# EasyEDA Pro project ProPrj_HSLinkTestBoard_2025-10-28.epro

# Schematic Schematic1
Board Name: Board1; Create Date: 2025-04-19; Page Name: P1; Project Name: HSLinkTestBoard; Schematic Name: Schematic1; Update Date: 2025-04-21; Company: 嘉立创EDA; Page Size: A4; Version: V1.0
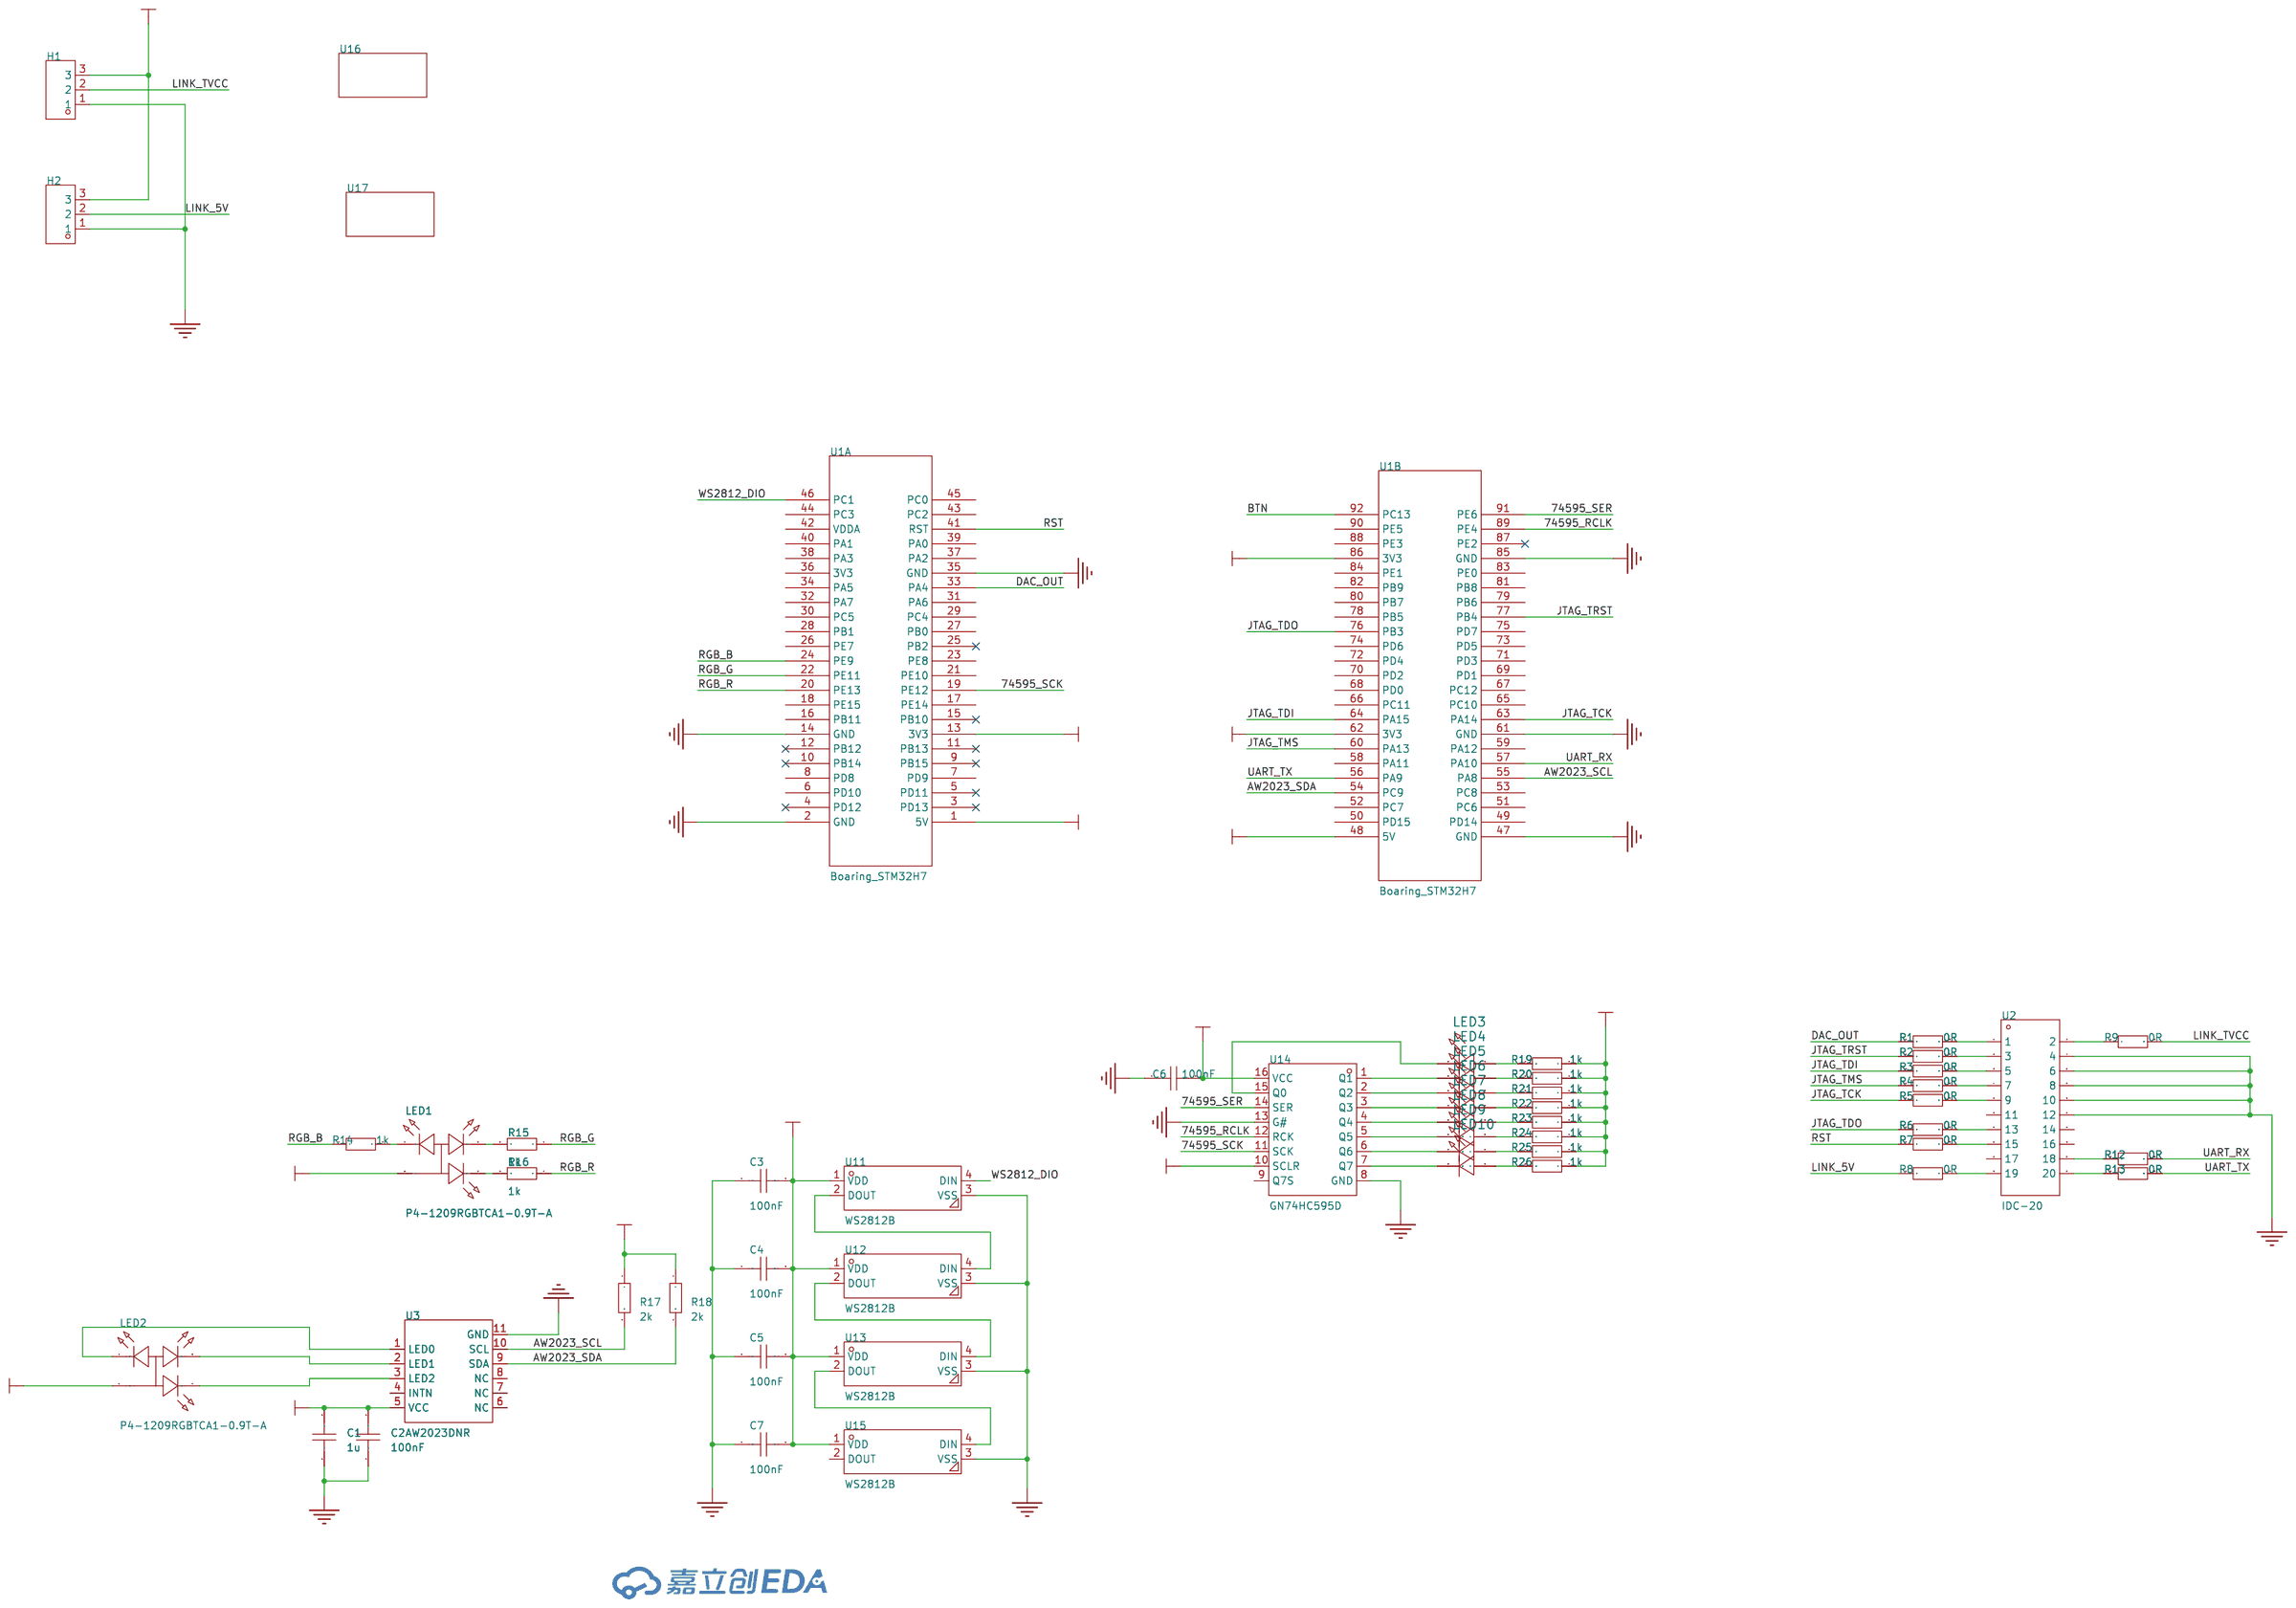
[diagram p0: schematic sheet]

## Parts
C1  1u  [C0603]
C2  100nF  [C0603]
C3  100nF  [C0603]
C4  100nF  [C0603]
C5  100nF  [C0603]
C6  100nF  [C0603]
C7  100nF  [C0603]
H1  -  [HDR-TH_3P-P2.54-V-F]
H2  -  [HDR-TH_3P-P2.54-V-F]
LED1  P4-1209RGBTCA1-0.9T-A  [LED-SMD_4P-L3.2-W2.7-TL-CW]
LED2  P4-1209RGBTCA1-0.9T-A  [LED-SMD_4P-L3.2-W2.7-TL-CW]
LED3  -  [LED_0603]
LED4  -  [LED_0603]
LED5  -  [LED_0603]
LED6  -  [LED_0603]
LED7  -  [LED_0603]
LED8  -  [LED_0603]
LED9  -  [LED_0603]
LED10  -  [LED_0603]
R1  0R  [R0603]
R2  0R  [R0603]
R3  0R  [R0603]
R4  0R  [R0603]
R5  0R  [R0603]
R6  0R  [R0603]
R7  0R  [R0603]
R8  0R  [R0603]
R9  0R  [R0603]
R12  0R  [R0603]
R13  0R  [R0603]
R14  1k  [R0603]
R15  1k  [R0603]
R16  1k  [R0603]
R17  2k  [R0603]
R18  2k  [R0603]
R19  1k  [R0603]
R20  1k  [R0603]
R21  1k  [R0603]
R22  1k  [R0603]
R23  1k  [R0603]
R24  1k  [R0603]
R25  1k  [R0603]
R26  1k  [R0603]
U1  Boaring_STM32H7  [Boaring_STM32H7]  (sections 1,2)
U2  IDC-20  [IDC-TH_20P-P2.54-V-R2-C10-S2.54]
U3  AW2023DNR  [DFN-10_L2.0-W2.0-P0.40-BL-EP]
U11  WS2812B  [LED-SMD_4P-L5.0-W5.0-TL]
U12  WS2812B  [LED-SMD_4P-L5.0-W5.0-TL]
U13  WS2812B  [LED-SMD_4P-L5.0-W5.0-TL]
U14  GN74HC595D  [SOP-16_L9.9-W3.9-P1.27-LS6.0-BL]
U15  WS2812B  [LED-SMD_4P-L5.0-W5.0-TL]
U16  -  [0.36寸裸表]
U17  -  [0.36寸裸表]

## Library data of the parts
C1-C7 = CAP_0603: Supplier Footprint: 0603
H1 H2 = HDR-F_2.54_1x3P: Supplier Part: C541850; Supplier Footprint: 插件
LED1 LED2 = P4-1209RGBTCA1-0.9T-A: LCSC Part Name: RGB三色; Supplier Part: C2827302; Manufacturer: TUOZHAN(拓展光电); Supplier Footprint: 1210; JLCPCB Part Class: 扩展库; Datasheet: https://atta.szlcsc.com/upload/public/pdf/source/20230317/55FD41526E8F063658A563CEBFD05C6F.pdf; Supplier: LCSC
LED3-LED10 = LED_0603-R: Supplier Footprint: 0603
R1-R9 R12-R26 = Res_0603: Supplier Footprint: 0603
U1 = Boaring_STM32H7
U2 = IDC-20: Supplier Part: C9900015890; Supplier Footprint: JTAG; JLCPCB Part Class: 扩展库; Supplier: LCSC
U3 = AW2023DNR: LCSC Part Name: 呼吸灯驱动; Supplier Part: C401014; Manufacturer: AWINIC(艾为); Supplier Footprint: DFN-10-EP(2x2); JLCPCB Part Class: 扩展库; Datasheet: https://atta.szlcsc.com/upload/public/pdf/source/20190701/C401014_E271E65E1E1F305DEBF1DEC8ED5DFBB8.pdf; Supplier: LCSC
U11-U13 U15 = WS2812B_1: Supplier Part: C9900106807; Supplier Footprint: SMD-LED-5328; JLCPCB Part Class: 扩展库; Supplier: LCSC
U14 = GN74HC595D: 低噪声、低功耗、高速的COMS移位寄存器，能够驱动15个LS-TTL的负载。8位串行输入，并行输出的移位寄存器及带有三态输出控制的8位D行储存器。; LCSC Part Name: 移位寄存器; Supplier Part: C22461436; Manufacturer: GN(旌芯半导体); Supplier Footprint: SOP-16; JLCPCB Part Class: 扩展库; Datasheet: https://atta.szlcsc.com/upload/public/pdf/source/20240605/C1B56835D1901C8811C7DC4991F054CF.pdf; Supplier: LCSC
U16 U17 = 0.36luobiao

## Nets
3.3V: C1.2 C2.2 C6.2 LED1.3(A) LED2.3(A) R17.1 R18.1 R19.1 R20.1 R21.1 R22.1 R23.1 R24.1 R25.1 R26.1 U1.13(3V3) U1.62(3V3) U1.86(3V3) U3.5(VCC) U14.10(SCLR) U14.16(VCC)
5V: C3.2 C4.2 C5.2 C7.2 H1.3 H2.3 U1.1(5V) U1.48(5V) U11.1(VDD) U12.1(VDD) U13.1(VDD) U15.1(VDD)
GND: C1.1 C2.1 C3.1 C4.1 C5.1 C6.1 C7.1 H1.1 H2.1 U1.2(GND) U1.14(GND) U1.35(GND) U1.47(GND) U1.61(GND) U1.85(GND) U2.4 U2.6 U2.8 U2.10 U2.12 U3.11(GND) U11.3(VSS) U12.3(VSS) U13.3(VSS) U14.8(GND) U14.13(G#) U15.3(VSS)
74595_RCLK: U1.89(PE4) U14.12(RCK)
74595_SCK: U1.19(PE12) U14.11(SCK)
74595_SER: U1.91(PE6) U14.14(SER)
AW2023_SCL: R17.2 U1.55(PA8) U3.10(SCL)
AW2023_SDA: R18.2 U1.54(PC9) U3.9(SDA)
BTN: U1.92(PC13)
DAC_OUT: R1.1 U1.33(PA4)
JTAG_TCK: R5.1 U1.63(PA14)
JTAG_TDI: R3.1 U1.64(PA15)
JTAG_TDO: R6.1 U1.76(PB3)
JTAG_TMS: R4.1 U1.60(PA13)
JTAG_TRST: R2.1 U1.77(PB4)
LINK_5V: H2.2 R8.1
LINK_TVCC: H1.2 R9.2
RGB_B: R14.1 U1.24(PE9)
RGB_G: R15.1 U1.22(PE11)
RGB_R: R16.1 U1.20(PE13)
RST: R7.1 U1.41(RST)
UART_RX: R12.2 U1.57(PA10)
UART_TX: R13.2 U1.56(PA9)
WS2812_DIO: U1.46(PC1) U11.4(DIN)
$1N1066: R1.2 U2.1
$1N1070: R2.2 U2.3
$1N1075: R3.2 U2.5
$1N1080: R4.2 U2.7
$1N1085: R5.2 U2.9
$1N1132: R6.2 U2.13
$1N1163: R7.2 U2.15
$1N1194: R8.2 U2.19
$1N1220: R9.1 U2.2
$1N1443: R12.1 U2.18
$1N1448: R13.1 U2.20
$1N1645: LED1.1(K) R14.2
$1N1680: LED1.2(K) R15.2
$1N1709: LED1.4(K) R16.2
$1N1996: LED2.2(K) U3.2(LED1)
$1N2016: LED2.4(K) U3.3(LED2)
$1N2050: LED2.1(K) U3.1(LED0)
$1N2657: U11.2(DOUT) U12.4(DIN)
$1N2671: U12.2(DOUT) U13.4(DIN)
$1N3018: LED3.1(C) U14.15(Q0)
$1N3024: LED3.2(A) R19.2
$1N3092: LED4.2(A) R20.2
$1N3143: LED5.2(A) R21.2
$1N3194: LED6.2(A) R22.2
$1N3245: LED7.2(A) R23.2
$1N3296: LED8.2(A) R24.2
$1N3347: LED9.2(A) R25.2
$1N3449: LED10.2(A) R26.2
$1N3471: LED4.1(C) U14.1(Q1)
$1N3475: LED5.1(C) U14.2(Q2)
$1N3480: LED6.1(C) U14.3(Q3)
$1N3485: LED7.1(C) U14.4(Q4)
$1N3490: LED8.1(C) U14.5(Q5)
$1N3495: LED9.1(C) U14.6(Q6)
$1N3500: LED10.1(C) U14.7(Q7)
$1N4542: U13.2(DOUT) U15.4(DIN)

Not connected (* = marked no-connect by the designer): U1 3(PD13)* 4(PD12)* 5(PD11)* 6(PD10) 7(PD9) 8(PD8) 9(PB15)* 10(PB14)* 11(PB13)* 12(PB12)* 15(PB10)* 16(PB11) 17(PE14) 18(PE15) 21(PE10) 23(PE8) 25(PB2)* 26(PE7) 27(PB0) 28(PB1) 29(PC4) 30(PC5) 31(PA6) 32(PA7) 34(PA5) 36(3V3) 37(PA2) 38(PA3) 39(PA0) 40(PA1) 42(VDDA) 43(PC2) 44(PC3) 45(PC0) 49(PD14) 50(PD15) 51(PC6) 52(PC7) 53(PC8) 58(PA11) 59(PA12) 65(PC10) 66(PC11) 67(PC12) 68(PD0) 69(PD1) 70(PD2) 71(PD3) 72(PD4) 73(PD5) 74(PD6) 75(PD7) 78(PB5) 79(PB6) 80(PB7) 81(PB8) 82(PB9) 83(PE0) 84(PE1) 87(PE2)* 88(PE3) 90(PE5); U2 11 14 16 17; U3 4(INTN) 6(NC) 7(NC) 8(NC); U14 9(Q7S); U15 2(DOUT)

# Board PCB1
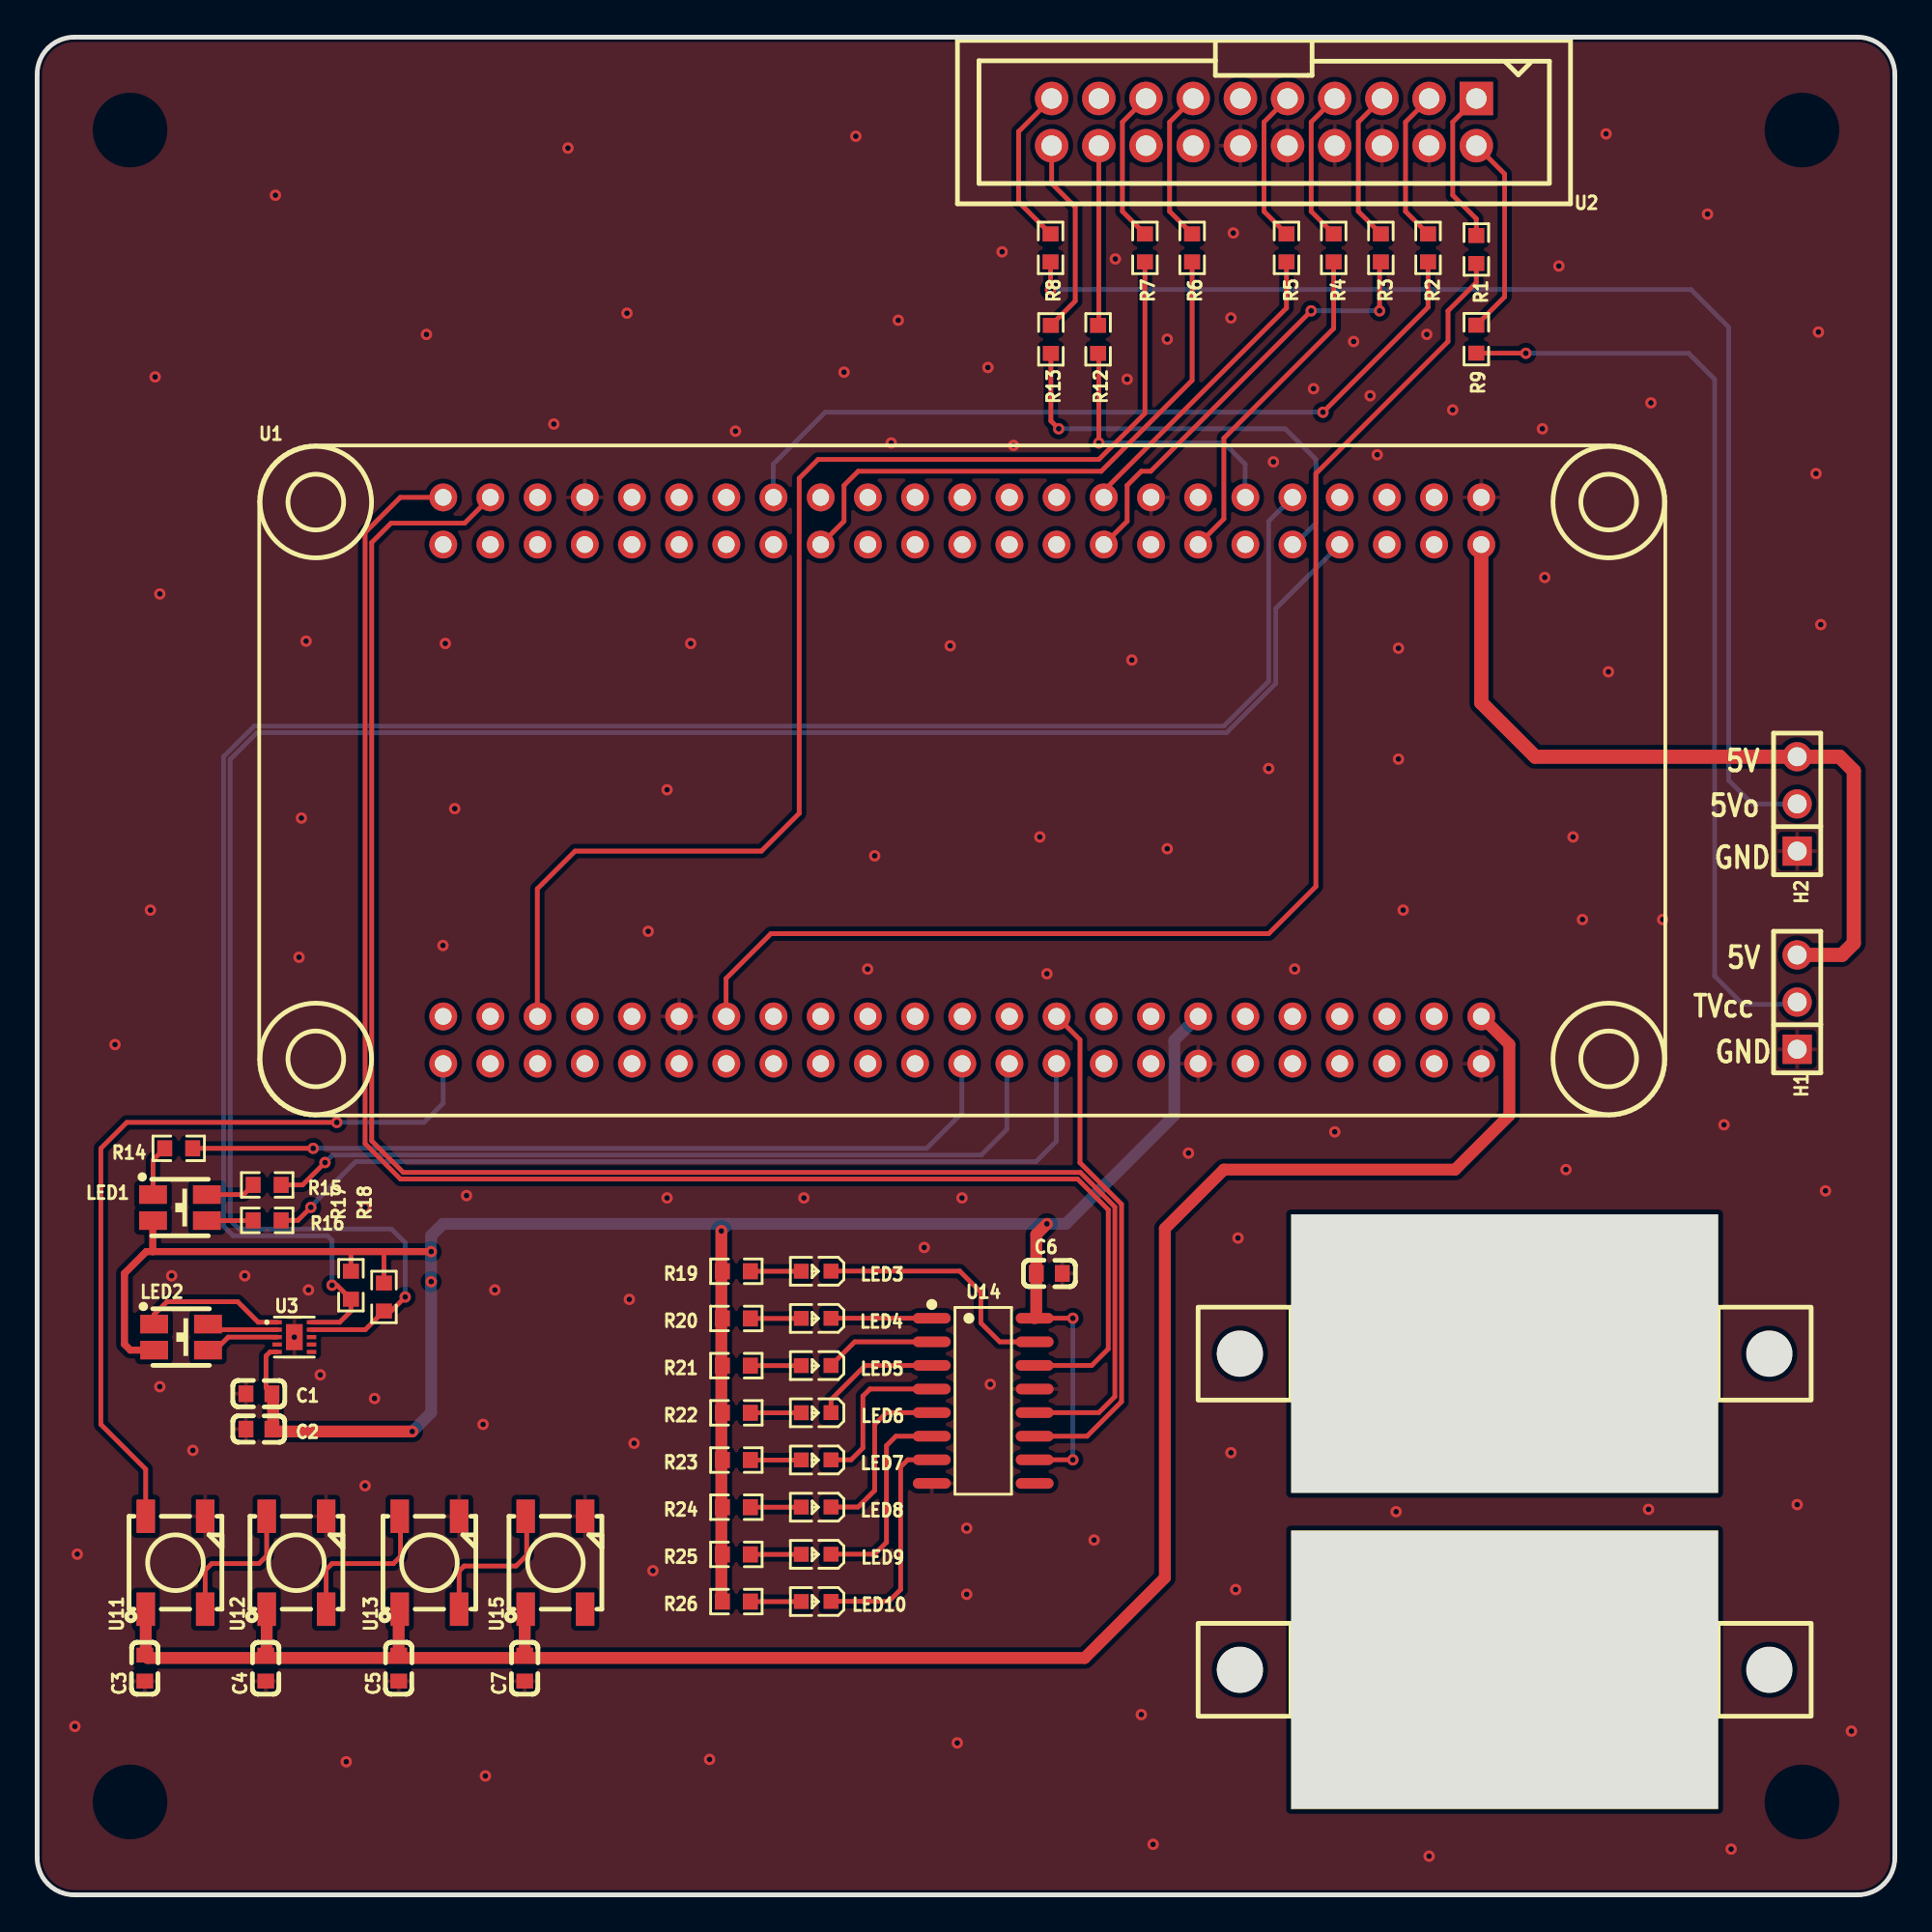
[diagram p1: board, top side]
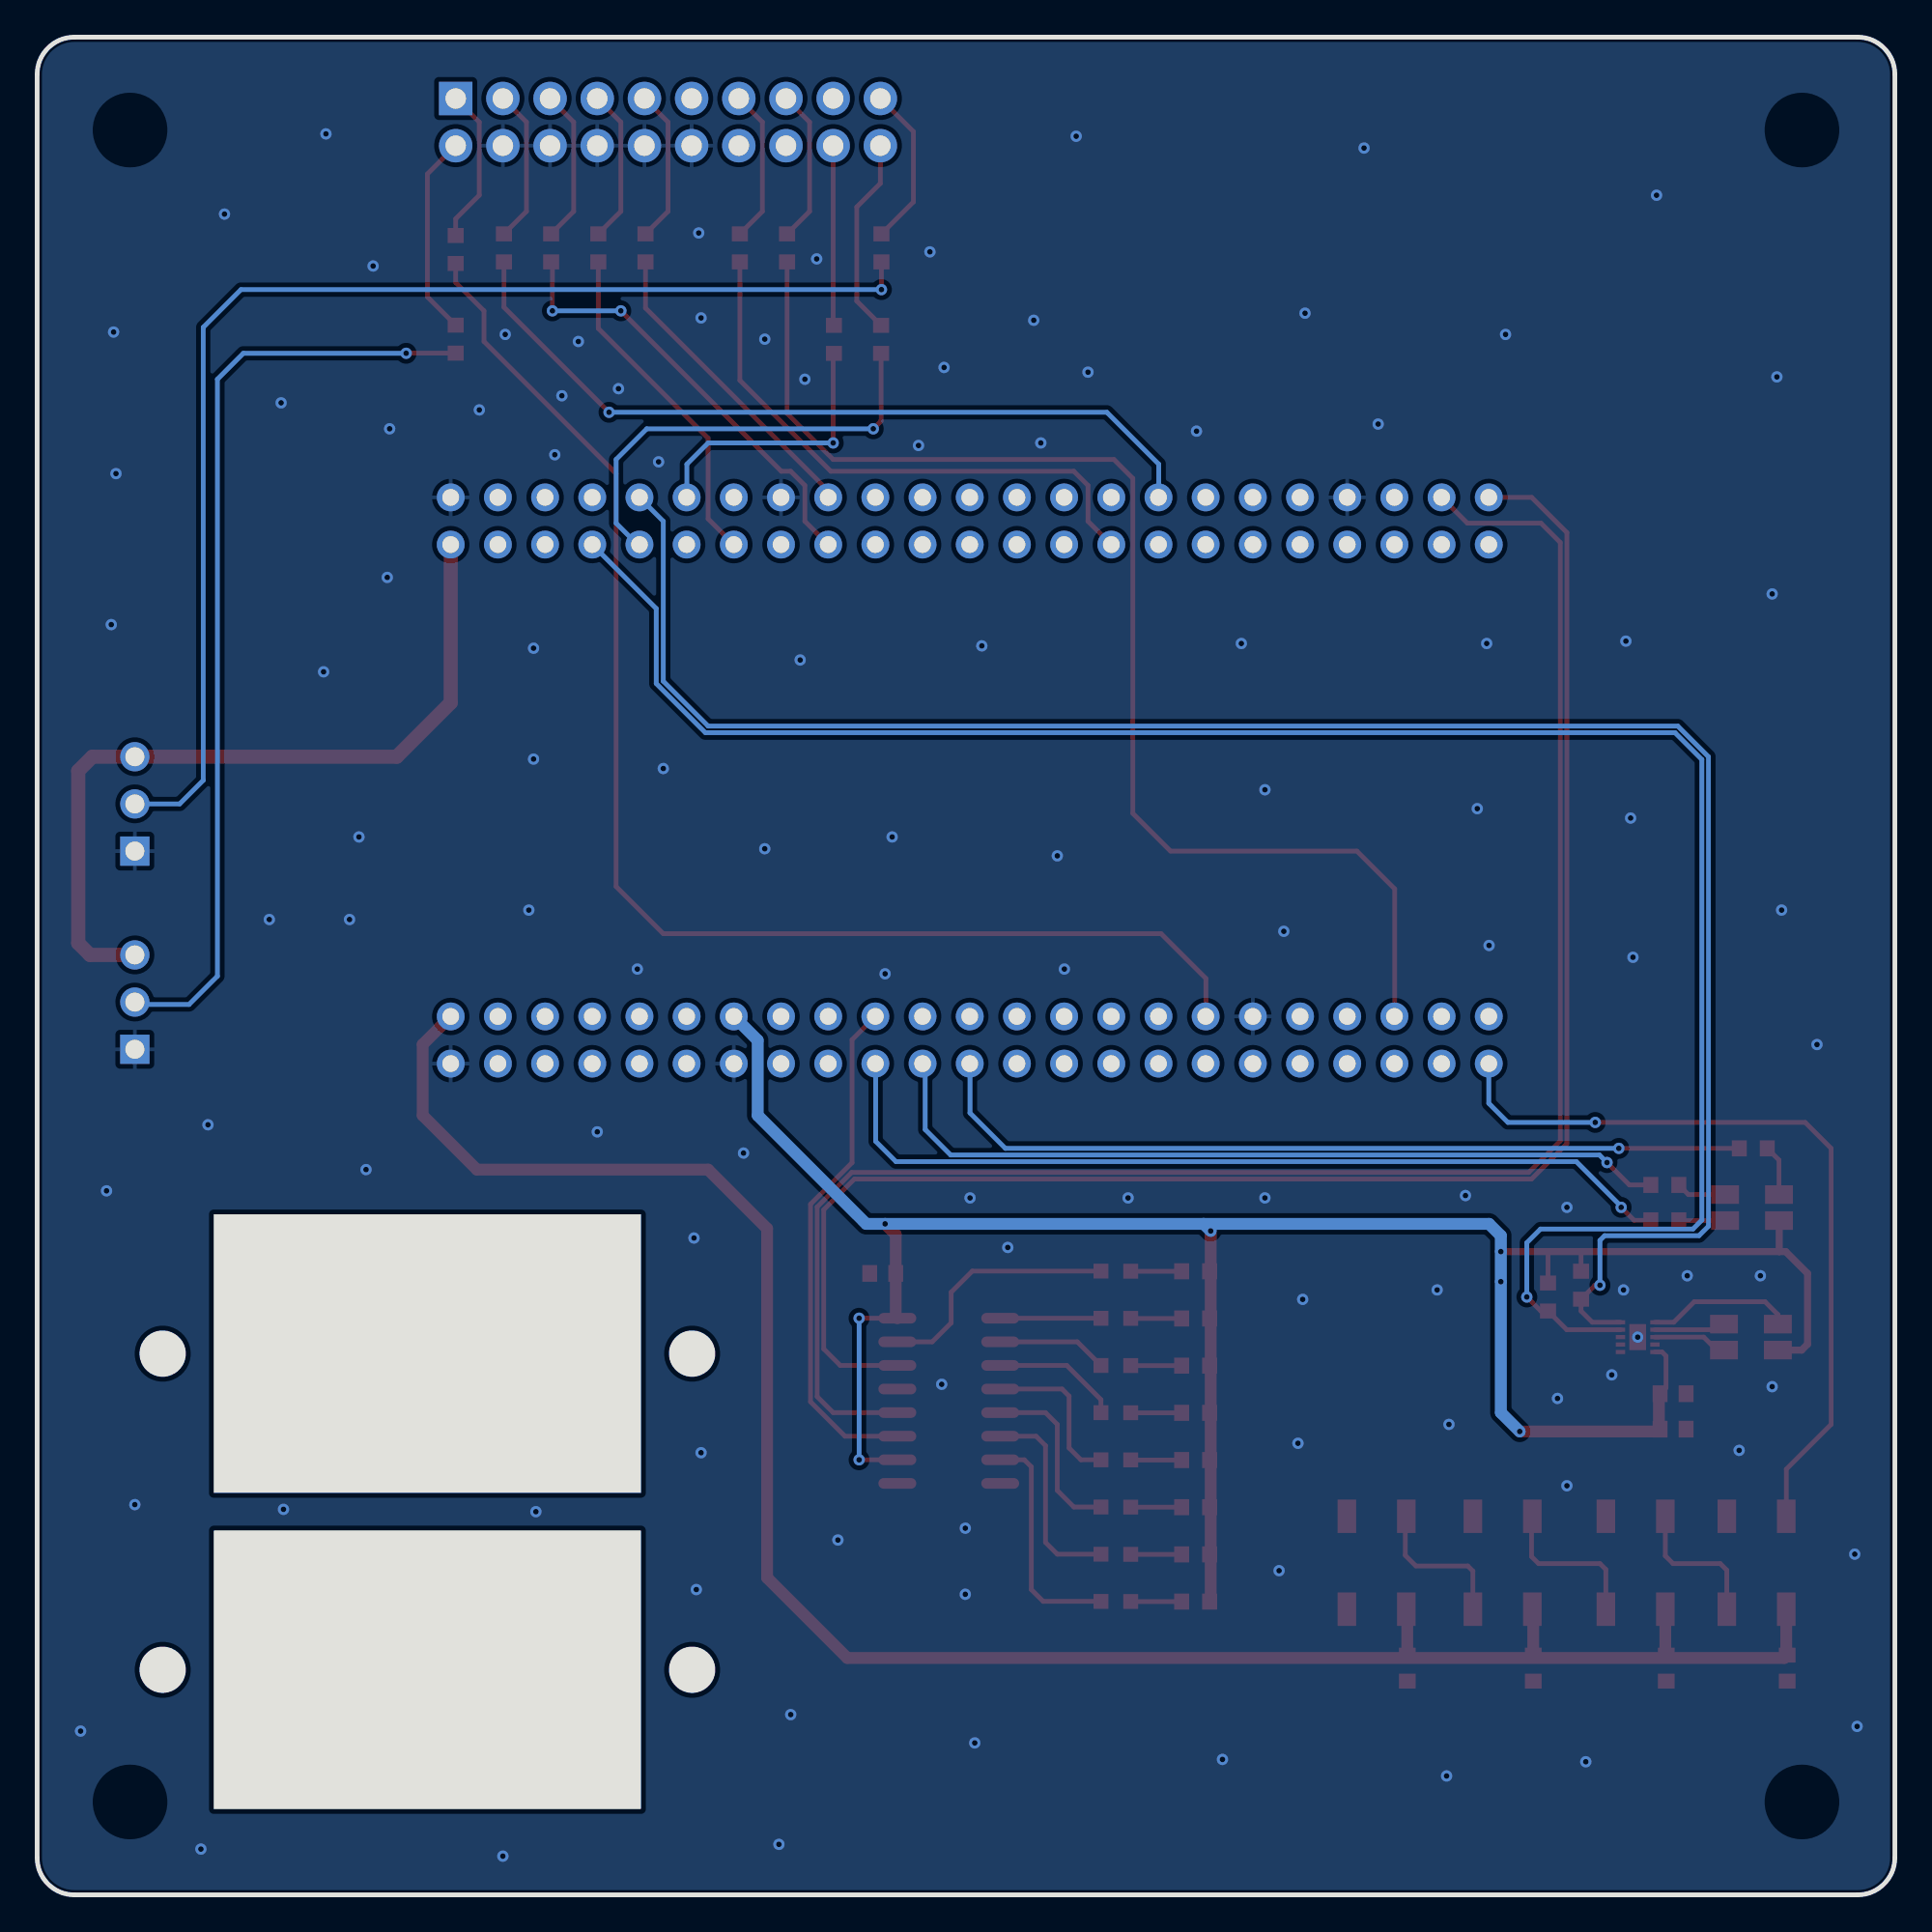
[diagram p2: board, bottom side, seen from below]

Outline 100 x 100 mm; copper layers: Top Layer, Bottom Layer. Coordinates in mm from the lower left corner of the outline.
Outline path: 0,98 0,2 arc(0.59,0.59) 2,0 98,0 arc(99.41,0.59) 100,2 100,98 arc(99.41,99.41) 98,100 2,100 arc(0.59,99.41) 0,98
Stack: Top Layer 0.035mm / Dielectric1 1.51mm FR4 er 4.5 / Bottom Layer 0.035mm

## Design rules (mm)
template: JLCPCB Capability(Two Layers Board)
spacing copperThickness1oz (default): track to track 0.102, other pairs 0.152 to 0.3
spacing copperThickness2oz: track to track 0.203, other pairs 0.152 to 0.3
track width copperThickness1oz (default): min 0.127, default 0.254, max 2.54
track width copperThickness2oz: min 0.203, default 0.254, max 2.54
differential pair differentialPair (default): width min 0.127, default 0.254, max 2.54; gap min 0.152, default 0.152
via viaSize (default): diameter min 0.5, default 0.61, max 10; hole min 0.3, default 0.305, max 6.3

## Placement (name value [footprint] x y rotation side)
C1  1u  [C0603]  11.94 26.97 0 top
C2  100nF  [C0603]  11.94 25.07 0 top
C3  100nF  [C0603]  5.8 12.21 90 top
C4  100nF  [C0603]  12.3 12.21 90 top
C5  100nF  [C0603]  19.46 12.21 90 top
C6  100nF  [C0603]  54.48 33.45 180 top
C7  100nF  [C0603]  26.25 12.21 90 top
H1  -  [HDR-TH_3P-P2.54-V-F]  94.74 48.06 90 top
H2  -  [HDR-TH_3P-P2.54-V-F]  94.74 58.72 90 top
LED1  P4-1209RGBTCA1-0.9T-A  [LED-SMD_4P-L3.2-W2.7-TL-CW]  7.69 37 0 top
LED2  P4-1209RGBTCA1-0.9T-A  [LED-SMD_4P-L3.2-W2.7-TL-CW]  7.75 30.02 0 top
LED3  -  [LED_0603]  41.88 33.57 180 top
LED4  -  [LED_0603]  41.88 31.03 180 top
LED5  -  [LED_0603]  41.88 28.49 180 top
LED6  -  [LED_0603]  41.88 25.95 180 top
LED7  -  [LED_0603]  41.88 23.41 180 top
LED8  -  [LED_0603]  41.88 20.87 180 top
LED9  -  [LED_0603]  41.88 18.33 180 top
LED10  -  [LED_0603]  41.88 15.79 180 top
R1  0R  [R0603]  77.47 88.57 90 top
R2  0R  [R0603]  74.87 88.66 90 top
R3  0R  [R0603]  72.33 88.66 90 top
R4  0R  [R0603]  69.79 88.66 90 top
R5  0R  [R0603]  67.25 88.66 90 top
R6  0R  [R0603]  62.17 88.66 90 top
R7  0R  [R0603]  59.63 88.66 90 top
R8  0R  [R0603]  54.55 88.66 90 top
R9  0R  [R0603]  77.47 83.74 270 top
R12  0R  [R0603]  57.11 83.73 270 top
R13  0R  [R0603]  54.57 83.73 270 top
R14  1k  [R0603]  7.62 40.18 180 top
R15  1k  [R0603]  12.38 38.21 180 top
R16  1k  [R0603]  12.38 36.31 180 top
R17  2k  [R0603]  16.89 32.82 270 top
R18  2k  [R0603]  18.67 32.18 270 top
R19  1k  [R0603]  37.64 33.57 0 top
R20  1k  [R0603]  37.64 31.03 0 top
R21  1k  [R0603]  37.64 28.49 0 top
R22  1k  [R0603]  37.64 25.95 0 top
R23  1k  [R0603]  37.64 23.41 0 top
R24  1k  [R0603]  37.64 20.87 0 top
R25  1k  [R0603]  37.64 18.33 0 top
R26  1k  [R0603]  37.64 15.79 0 top
U1  -  [Boaring_STM32H7]  15 45 0 top
U2  IDC-20  [IDC-TH_20P-P2.54-V-R2-C10-S2.54]  66.04 95.43 180 top
U3  AW2023DNR  [DFN-10_L2.0-W2.0-P0.40-BL-EP]  13.84 30.02 270 top
U11  WS2812B  [LED-SMD_4P-L5.0-W5.0-TL]  7.45 17.88 90 top
U12  WS2812B  [LED-SMD_4P-L5.0-W5.0-TL]  13.96 17.88 90 top
U13  WS2812B  [LED-SMD_4P-L5.0-W5.0-TL]  21.11 17.88 90 top
U14  GN74HC595D  [SOP-16_L9.9-W3.9-P1.27-LS6.0-BL]  50.93 26.59 270 top
U15  WS2812B  [LED-SMD_4P-L5.0-W5.0-TL]  27.9 17.88 90 top
U16  -  [0.36寸裸表]  78.99 29.13 0 top
U17  -  [0.36寸裸表]  78.99 12.12 0 top

## Footprints (pads in the part's own frame, mm; a bottom-side part is the same pattern mirrored in y, then rotated)
Boaring_STM32H7
  round 1.5 hole 0.9: 1(62.738,2.286) 2(62.738,-0.254) 3(60.198,2.286) 4(60.198,-0.254) 5(57.658,2.286) 6(57.658,-0.254) 7(55.118,2.286) 8(55.118,-0.254) 9(52.578,2.286) 10(52.578,-0.254) 11(50.038,2.286) 12(50.038,-0.254) 13(47.498,2.286) 14(47.498,-0.254) 15(44.958,2.286) 16(44.958,-0.254) 17(42.418,2.286) 18(42.418,-0.254) 19(39.878,2.286) 20(39.878,-0.254) 21(37.338,2.286) 22(37.338,-0.254) 23(34.798,2.286) 24(34.798,-0.254) 25(32.258,2.286) 26(32.258,-0.254) 27(29.718,2.286) 28(29.718,-0.254) 29(27.178,2.286) 30(27.178,-0.254) 31(24.638,2.286) 32(24.638,-0.254) 33(22.098,2.286) 34(22.098,-0.254) 35(19.558,2.286) 36(19.558,-0.254) 37(17.018,2.286) 38(17.018,-0.254) 39(14.478,2.286) 40(14.478,-0.254) 41(11.938,2.286) 42(11.938,-0.254) 43(9.398,2.286) 44(9.398,-0.254) 45(6.858,2.286) 46(6.858,-0.254) 47(62.738,30.226) 48(62.738,27.686) 49(60.198,30.226) 50(60.198,27.686) 51(57.658,30.226) 52(57.658,27.686) 53(55.118,30.226) 54(55.118,27.686) 55(52.578,30.226) 56(52.578,27.686) 57(50.038,30.226) 58(50.038,27.686) 59(47.498,30.226) 60(47.498,27.686) 61(44.958,30.226) 62(44.958,27.686) 63(42.418,30.226) 64(42.418,27.686) 65(39.878,30.226) 66(39.878,27.686) 67(37.338,30.226) 68(37.338,27.686) 69(34.798,30.226) 70(34.798,27.686) 71(32.258,30.226) 72(32.258,27.686) 73(29.718,30.226) 74(29.718,27.686) 75(27.178,30.226) 76(27.178,27.686) 77(24.638,30.226) 78(24.638,27.686) 79(22.098,30.226) 80(22.098,27.686) 81(19.558,30.226) 82(19.558,27.686) 83(17.018,30.226) 84(17.018,27.686) 85(14.478,30.226) 86(14.478,27.686) 87(11.938,30.226) 88(11.938,27.686) 89(9.398,30.226) 90(9.398,27.686) 91(6.858,30.226) 92(6.858,27.686)
C0603
  rect 0.8x0.9 smd: 1(-0.7,0) 2(0.7,0)
DFN-10_L2.0-W2.0-P0.40-BL-EP
  rect 0.224x0.505 smd: 1(-0.8,-0.927) 2(-0.4,-0.927) 3(0,-0.927) 4(0.4,-0.927) 5(0.8,-0.927) 6(0.8,0.927) 7(0.4,0.927) 8(0,0.927) 9(-0.4,0.927) 10(-0.8,0.927)
  rect 1.4x0.9 smd: 11(0,0)
HDR-TH_3P-P2.54-V-F
  rect 1.575x1.575 hole 1.02: 1(-2.54,0)
  round 1.575 hole 1.02: 2(0,0) 3(2.54,0)
IDC-TH_20P-P2.54-V-R2-C10-S2.54
  rect 1.8x1.8 hole 1.1: 1(-11.43,-1.27)
  round 1.8 hole 1.1: 2(-11.43,1.27) 3(-8.89,-1.27) 4(-8.89,1.27) 5(-6.35,-1.27) 6(-6.35,1.27) 7(-3.81,-1.27) 8(-3.81,1.27) 9(-1.27,-1.27) 10(-1.27,1.27) 11(1.27,-1.27) 12(1.27,1.27) 13(3.81,-1.27) 14(3.81,1.27) 15(6.35,-1.27) 16(6.35,1.27) 17(8.89,-1.27) 18(8.89,1.27) 19(11.43,-1.27) 20(11.43,1.27)
LED-SMD_4P-L3.2-W2.7-TL-CW
  rect 1.5x1 smd: 1(-1.45,0.7) 2(1.45,0.7) 3(-1.45,-0.7) 4(1.45,-0.7)
LED-SMD_4P-L5.0-W5.0-TL
  rect 1.8x1 smd: 1(-2.5,1.6) 2(-2.5,-1.6) 3(2.5,-1.6) 4(2.5,1.6)
LED_0603
  rect 0.8x0.8 smd: 1(-0.851,-0.01) 2(0.75,-0.005)
R0603
  rect 0.806x0.864 smd: 1(-0.753,0) 2(0.753,0)
SOP-16_L9.9-W3.9-P1.27-LS6.0-BL
  oval 0.574x2.038 smd: 1(-4.445,-2.769) 2(-3.175,-2.769) 3(-1.905,-2.769) 4(-0.635,-2.769) 5(0.635,-2.769) 6(1.905,-2.769) 7(3.175,-2.769) 8(4.445,-2.769) 9(4.445,2.769) 10(3.175,2.769) 11(1.905,2.769) 12(0.635,2.769) 13(-0.635,2.769) 14(-1.905,2.769) 15(-3.175,2.769) 16(-4.445,2.769)

## Nets
As in the schematic.

Pads without a net: U1 3 4 5 6 7 8 9 10 11 12 15 16 17 18 21 23 25 26 27 28 29 30 31 32 34 36 37 38 39 40 42 43 44 45 49 50 51 52 53 58 59 65 66 67 68 69 70 71 72 73 74 75 78 79 80 81 82 83 84 87 88 90; U2 11 14 16 17; U3 4 6 7 8; U14 9; U15 2

## Via types
v1: diameter 0.61, hole 0.305, Top Layer to Bottom Layer, 129 vias

## Routing (per net, layer and track width the routed paths; a pad name or vN(x,y) marks a point on that pad's centre or on a via; arc(x,y) is an arc through that point)
3.3V: length 136.4
  Top Layer w0.254: R18.1 18.67,34.62 18.66,34.63 ; 16.9,34.63 16.89,34.62 R17.1 ; 12.92,29.22 12.53,29.22 12.32,29.01 12.32,27.29 C1.2 ; 53.7,23.42 v1(55.75,23.42) ; v1(55.75,31.04) U14.16
  Top Layer w0.381: LED2.3 5.02,29.32 4.7,29.64 4.7,33.45 5.87,34.63 6.22,34.63 ; 6.22,34.63 v1(21.21,34.63) ; 6.22,34.63 6.22,36.28 LED1.3
  Top Layer w0.635: v1(20.19,24.94) 12.83,24.94 12.7,25.07 12.7,26.91 C1.2 ; v1(36.83,35.74) 36.83,15.84 36.89,15.79 ; U14.16 53.78,31.13 C6.2 53.78,35.55 v1(54.36,36.12)
  Bottom Layer w0.254: v1(55.75,23.42) v1(55.75,31.04)
  Bottom Layer w0.635: 37.21,36.12 v1(54.36,36.12) 55.37,36.12 61.21,41.96 61.21,46 U1.13 ; 37.21,36.12 21.84,36.12 21.21,35.48 v1(21.21,34.63) v1(21.21,33.01) 21.21,25.96 v1(20.19,24.94) ; 37.21,36.12 v1(36.83,35.74)
5V: length 155.2
  Top Layer w0.635: U11.1 5.85,12.96 C3.2 5.95,12.75 56.39,12.75 60.71,17.07 60.71,35.86 63.88,39.04 76.33,39.04 79.25,41.96 79.25,45.78 U1.1 ; C5.2 19.46,15.33 19.52,15.38 ; C7.2 26.25,15.33 26.3,15.38 ; C4.2 12.36,12.96 U12.1
  Top Layer w0.762: U1.48 77.74,64.17 80.65,61.27 H2.3 97.03,61.27 97.79,60.5 97.79,51.23 97.16,50.6 94.74,50.6
GND:
  vias: v1(2.03,9.07) v1(2.16,18.34) v1(4.19,45.77) v1(6.1,53.01) v1(6.35,81.71) v1(6.6,70.03) v1(6.6,27.36) v1(7.24,33.33) v1(8.38,23.93) v1(11.18,33.33) v1(12.83,91.49) v1(13.84,30.02) v1(14.1,50.47) v1(14.22,57.96) v1(14.48,67.49) v1(14.61,32.56) v1(15.24,27.99) v1(16.64,7.16) v1(17.65,37.01) v1(17.65,22.02) v1(18.16,26.72) v1(20.95,84) v1(21.84,51.11) v1(21.97,67.36) v1(22.48,58.47) v1(23.11,37.64) v1(24,25.32) v1(24.13,6.4) v1(24.64,32.56) v1(27.81,79.17) v1(28.57,94.03) v1(31.75,85.14) v1(31.88,32.06) v1(32.13,24.31) v1(32.89,51.87) v1(33.15,17.45) v1(33.91,59.49) v1(33.91,37.52) v1(35.18,67.36) v1(36.19,7.29) v1(37.59,78.79) v1(41.28,37.52) v1(43.43,81.97) v1(44.07,94.67) v1(44.7,49.83) v1(45.09,55.93) v1(45.97,78.16) v1(46.35,84.76) v1(47.75,34.85) v1(49.15,67.23) v1(49.53,8.18) v1(49.78,37.52) v1(50.04,19.74) v1(50.04,16.18) v1(51.18,82.22) v1(51.31,27.48) v1(51.94,88.44) v1(52.56,78.02) v1(53.97,56.95) v1(54.36,49.58) v1(56.9,19.1) v1(58.04,88.06) v1(58.67,81.58) v1(58.93,66.47) v1(59.44,9.7) v1(60.07,2.72) v1(60.83,83.74) v1(60.83,56.31) v1(61.98,39.93) v1(64.26,84.89) v1(64.26,23.8) v1(64.39,89.46) v1(64.52,16.43) v1(64.64,35.36) v1(66.29,60.63) v1(66.55,77.14) v1(67.69,49.83) v1(68.71,81.08) v1(69.85,41.07) v1(70.87,83.62) v1(71.75,80.7) v1(72.14,77.52) v1(73.15,20.62) v1(73.28,67.11) v1(73.28,61.14) v1(73.53,53.01) v1(74.8,84) v1(74.93,2.08) v1(76.2,79.93) v1(81.03,78.92) v1(81.15,70.92) v1(81.91,87.68) v1(82.3,39.04) v1(82.68,56.95) v1(83.19,52.5) v1(84.46,94.79) v1(84.58,65.84) v1(86.74,20.75) v1(86.87,80.31) v1(87.5,52.5) v1(89.92,90.47) v1(90.81,41.45) v1(91.19,2.46) v1(94.74,21.01) v1(95.76,76.5) v1(95.88,84.12) v1(96.01,68.38) v1(96.27,37.9) v1(97.66,8.81)
74595_RCLK: length 96
  Top Layer w0.254: U1.89 23.01,73.84 19.05,73.84 18.01,72.8 18.01,40.58 19.71,38.89 56.15,38.89 58.01,37.03 58.01,26.82 57.15,25.96 U14.12
74595_SCK: length 27.6
  Top Layer w0.254: U1.19 56.13,46.03 56.13,39.41 58.37,37.18 58.37,26.54 56.51,24.69 U14.11
74595_SER: length 91.2
  Top Layer w0.254: U1.91 19.55,75.23 17.65,73.33 17.65,40.44 19.56,38.53 56.01,38.53 57.66,36.88 57.66,29.39 56.77,28.5 U14.14
AW2023_SCL: length 106.6
  Top Layer w0.254: v1(15.88,32.82) 16.14,32.82 R17.2 16.89,31.43 16.28,30.82 U3.10
  Bottom Layer w0.254: U1.55 66.29,73.94 66.29,65.33 63.88,62.92 11.68,62.92 10.03,61.27 10.03,35.99 10.54,35.48 15.62,35.48 15.88,35.23 v1(15.88,32.82)
AW2023_SDA: length 110.3
  Top Layer w0.254: v1(19.81,32.18) 19.06,31.43 R18.2 17.66,30.42 U3.9
  Bottom Layer w0.254: v1(19.81,32.18) 19.81,35.1 19.08,35.84 10.87,35.84 10.39,36.32 10.39,61.12 11.83,62.56 64.03,62.56 66.68,65.21 66.68,69.24 U1.54
DAC_OUT: length 73
  Top Layer w0.254: R1.1 77.47,86.79 75.95,85.27 75.95,83.62 68.83,76.5 68.83,54.28 66.29,51.74 39.5,51.74 37.08,49.33 37.08,47.3 U1.33
JTAG_TCK: length 16.7
  Top Layer w0.254: U1.63 57.42,75.58 67.25,85.42 R5.1
JTAG_TDI: length 23.8
  Top Layer w0.254: R3.1 72.26,87.83 v1(72.26,85.27) ; v1(68.58,85.27) 59.94,76.63 59.44,76.63 58.67,75.87 58.67,73.94 U1.64
  Bottom Layer w0.254: v1(68.58,85.27) v1(72.26,85.27)
JTAG_TDO: length 31.2
  Top Layer w0.254: U1.76 43.43,73.94 43.43,75.87 44.2,76.63 57.28,76.63 62.17,81.53 R6.1
JTAG_TMS: length 18.2
  Top Layer w0.254: R4.1 69.79,84.32 63.88,78.41 63.88,74.07 U1.60
JTAG_TRST: length 43
  Top Layer w0.254: v1(69.22,79.81) 74.87,85.46 R2.1
  Bottom Layer w0.254: U1.77 39.62,75.24 39.62,77.01 42.42,79.81 v1(69.22,79.81)
LINK_5V: length 67.4
  Top Layer w0.254: R8.1 v1(54.55,86.41)
  Bottom Layer w0.254: H2.2 92.33,58.72 91.06,60 91.06,84.38 89.03,86.41 v1(54.55,86.41)
LINK_TVCC: length 50.7
  Top Layer w0.254: v1(80.14,82.98) 80.13,82.99 R9.2
  Bottom Layer w0.254: H1.2 94.62,47.93 91.82,47.93 90.3,49.45 90.3,81.58 88.9,82.98 v1(80.14,82.98)
RGB_B: length 44.9
  Top Layer w0.254: R14.1 v1(14.86,40.18)
  Bottom Layer w0.254: v1(14.86,40.18) 47.88,40.18 49.78,42.09 49.78,44.73 U1.24
RGB_G: length 43.9
  Top Layer w0.254: v1(15.49,39.42) 14.29,38.21 R15.1
  Bottom Layer w0.254: U1.22 52.2,44.61 52.2,41.2 50.82,39.83 15.9,39.83 v1(15.49,39.42)
RGB_R: length 47.7
  Top Layer w0.254: v1(14.73,37.01) 14.03,36.31 R16.1
  Bottom Layer w0.254: v1(14.73,37.01) 14.73,37.06 17.14,39.47 53.77,39.47 54.86,40.56 54.86,44.73 U1.20
RST: length 68.9
  Top Layer w0.254: U1.41 26.92,47.3 26.92,54.15 28.96,56.19 38.99,56.19 41.02,58.22 41.02,76.25 42.04,77.27 57.15,77.27 59.63,79.75 R7.1
UART_RX: length 15
  Top Layer w0.254: R12.2 57.15,82.94 v1(57.15,78.16)
  Bottom Layer w0.254: U1.57 65.02,75.24 65.02,77.01 63.88,78.16 v1(57.15,78.16)
UART_TX: length 23.9
  Top Layer w0.254: v1(54.99,78.92) 54.57,79.34 R13.2
  Bottom Layer w0.254: U1.56 67.68,72.69 68.83,73.84 68.83,77.27 67.18,78.92 v1(54.99,78.92)
WS2812_DIO: length 42.4
  Top Layer w0.254: v1(16.13,41.58) 4.83,41.58 3.43,40.18 3.43,25.32 5.84,22.91 5.84,20.38 U11.4
  Bottom Layer w0.254: v1(16.13,41.58) 20.83,41.58 21.86,42.61 U1.46
$1N1066: length 8.4
  Top Layer w0.254: R1.2 77.47,90.22 76.2,91.49 76.2,95.43 U2.1
$1N1070: length 8.3
  Top Layer w0.254: R2.2 73.66,90.62 73.66,95.43 U2.3
$1N1075: length 8.3
  Top Layer w0.254: U2.5 71.12,95.43 71.12,90.62 R3.2
$1N1080: length 8.3
  Top Layer w0.254: R4.2 68.58,90.62 68.58,95.43 U2.7
$1N1085: length 8.3
  Top Layer w0.254: R5.2 66.04,90.62 66.04,95.43 U2.9
$1N1132: length 8.3
  Top Layer w0.254: U2.13 60.96,95.43 60.96,90.62 R6.2
$1N1163: length 8.3
  Top Layer w0.254: U2.15 58.42,95.43 58.42,90.62 R7.2
$1N1194: length 8.7
  Top Layer w0.254: U2.19 52.83,94.92 52.83,91.13 R8.2
$1N1220: length 10.9
  Top Layer w0.254: U2.2 78.99,92.63 78.99,86.02 R9.1
$1N1443: length 9.7
  Top Layer w0.254: R12.1 57.15,84.53 U2.18
$1N1448: length 10.7
  Top Layer w0.254: U2.20 54.61,92.13 55.88,90.86 55.88,85.8 R13.1
$1N1645: length 2.7
  Top Layer w0.254: R14.2 6.24,39.55 LED1.1
$1N1680: length 2.7
  Top Layer w0.254: R15.2 11.11,37.7 LED1.2
$1N1709: length 2.5
  Top Layer w0.254: LED1.4 11.61,36.3 R16.2
$1N1996: length 3.8
  Top Layer w0.254: 9.2,30.72 9.5,30.42 U3.2
$1N2016: length 4
  Top Layer w0.254: LED2.4 9.59,29.32 10.29,30.02 U3.3
$1N2050: length 7.9
  Top Layer w0.254: U3.1 11.9,30.82 10.8,31.93 6.98,31.93 6.3,31.24 6.3,30.72
$1N2657: length 7.9
  Top Layer w0.254: U12.4 12.36,18.25 11.94,17.83 9.4,17.83 9.05,17.48 U11.2
$1N2671: length 8.6
  Top Layer w0.254: 19.52,20.38 19.56,20.33 19.56,18.21 19.18,17.83 15.88,17.83 15.56,17.51 U12.2
$1N3018: length 13.5
  Top Layer w0.254: U14.15 51.82,29.77 50.8,30.78 50.8,32.44 49.66,33.58 42.74,33.58
$1N3024: length 2.7
  Top Layer w0.254: LED3.2 41.13,33.57 R19.2
$1N3092: length 2.7
  Top Layer w0.254: R20.2 41.13,31.03 LED4.2
$1N3143: length 2.7
  Top Layer w0.254: LED5.2 41.13,28.49 R21.2
$1N3194: length 2.7
  Top Layer w0.254: R22.2 41.13,25.95 LED6.2
$1N3245: length 2.7
  Top Layer w0.254: R23.2 41.13,23.41 LED7.2
$1N3296: length 2.7
  Top Layer w0.254: R24.2 41.13,20.87 LED8.2
$1N3347: length 2.7
  Top Layer w0.254: LED9.2 41.13,18.33 R25.2
$1N3449: length 2.7
  Top Layer w0.254: R26.2 41.13,15.79 LED10.2
$1N3471: length 5.4
  Top Layer w0.254: 42.74,31.04 42.74,31.04 U14.1
$1N3475: length 5.9
  Top Layer w0.254: 42.74,28.5 44.01,29.77 U14.2
$1N3480: length 6.9
  Top Layer w0.254: 42.74,25.96 42.74,26.66 44.58,28.5 U14.3
$1N3485: length 8.6
  Top Layer w0.254: U14.4 44.83,27.23 44.45,26.85 44.45,24.05 43.81,23.42 42.74,23.42 42.74,23.42
$1N3490: length 9.6
  Top Layer w0.254: U14.5 45.72,25.96 45.09,25.32 45.09,21.77 44.19,20.88 42.74,20.88
$1N3495: length 11.1
  Top Layer w0.254: U14.6 46.23,24.69 45.72,24.18 45.72,18.97 45.09,18.34 42.74,18.34 42.74,18.34
$1N3500: length 12.4
  Top Layer w0.254: 48.16,23.42 46.86,23.42 46.48,23.04 46.48,16.43 45.85,15.8 42.74,15.8 42.74,15.8
$1N4542: length 8.2
  Top Layer w0.254: 26.3,20.38 26.35,20.32 26.35,18.28 25.78,17.7 22.99,17.7 22.71,17.43 U13.2

## Copper pours and planes (outline as drawn; the poured copper is in the pictures)
GND on Top Layer: 0,100 100,100 100,0 0,0
GND on Bottom Layer: 0,100 100,100 100,0 0,0

## Text on the board
Top Silkscreen Layer: TVcc | 5Vo | GND | 5V
